# Altium project kr2_1.PrjPcb
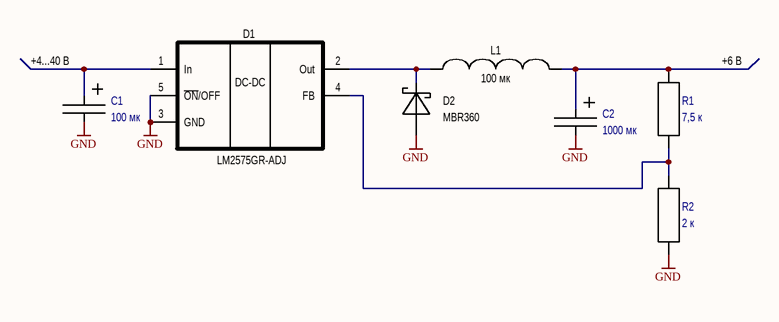
[diagram p0: kr2_1.SchDoc]
1 sheet, 7 parts. Net scope: global (net labels, ports and power ports of the same name join across sheets).

## Sheet kr2_1.SchDoc
size 420 x 297 mm; SheetNumber: 1; SheetTotal: 1

### Parts
C1  value 100 мк  (hidden comment: 100 мкФ ±* * * *, *)
C2  value 1000 мк  (hidden comment: 1000 мкФ ±* * * *, *)
D1  LM2575GR-ADJ
D2  MBR360
L1  100 мк
R1  value 7,5 к
R2  value 2 к

### Nets
GND: C1.2 C2.2 D1.3(GND) D1.5(~{ON}/OFF) D2.1(A) R2.2
NetC1_1: C1.1 D1.1(In)
NetC2_1: C2.1 R1.1
NetD1_2: D1.2(Out) D2.1(C)
NetD1_4: D1.4(FB) R1.2 R2.1

### Notes on the sheet
- (near C1) +4...40 В
- +6 В
- Перв.примен.
- Справ. №
- Подп. и дата
- Инв.№ дубл.
- Взам. инв. №
- Изм.
- Лист
- № докум.
- Подп.
- Дата
- Лит.
- Масса
- Масштаб
- Пров.
- Т.контр
- Разраб.
- Схема электрическая принципиальная
- 1
- Листов
- Инв № подл.
- Н.контр.
- Утв.
- Копировал
- Формат А3
- (in symbol LM2575GR-ADJ) DC-DC

### Library data of the parts
C1 C2 = C+: Company: *; Tolerance: *; Voltage: *; Type: *; PartNumber: *; Package: *
D2 = 1N5821
L1 = Inductor Sumida
R1 R2 = R: Company: *; PartNumber: *; Package: *; Tolerance: *